# EAGLE schematic dual-dac-w-32-ch-sh-DAC-BOARD (EAGLE 7.2.0)
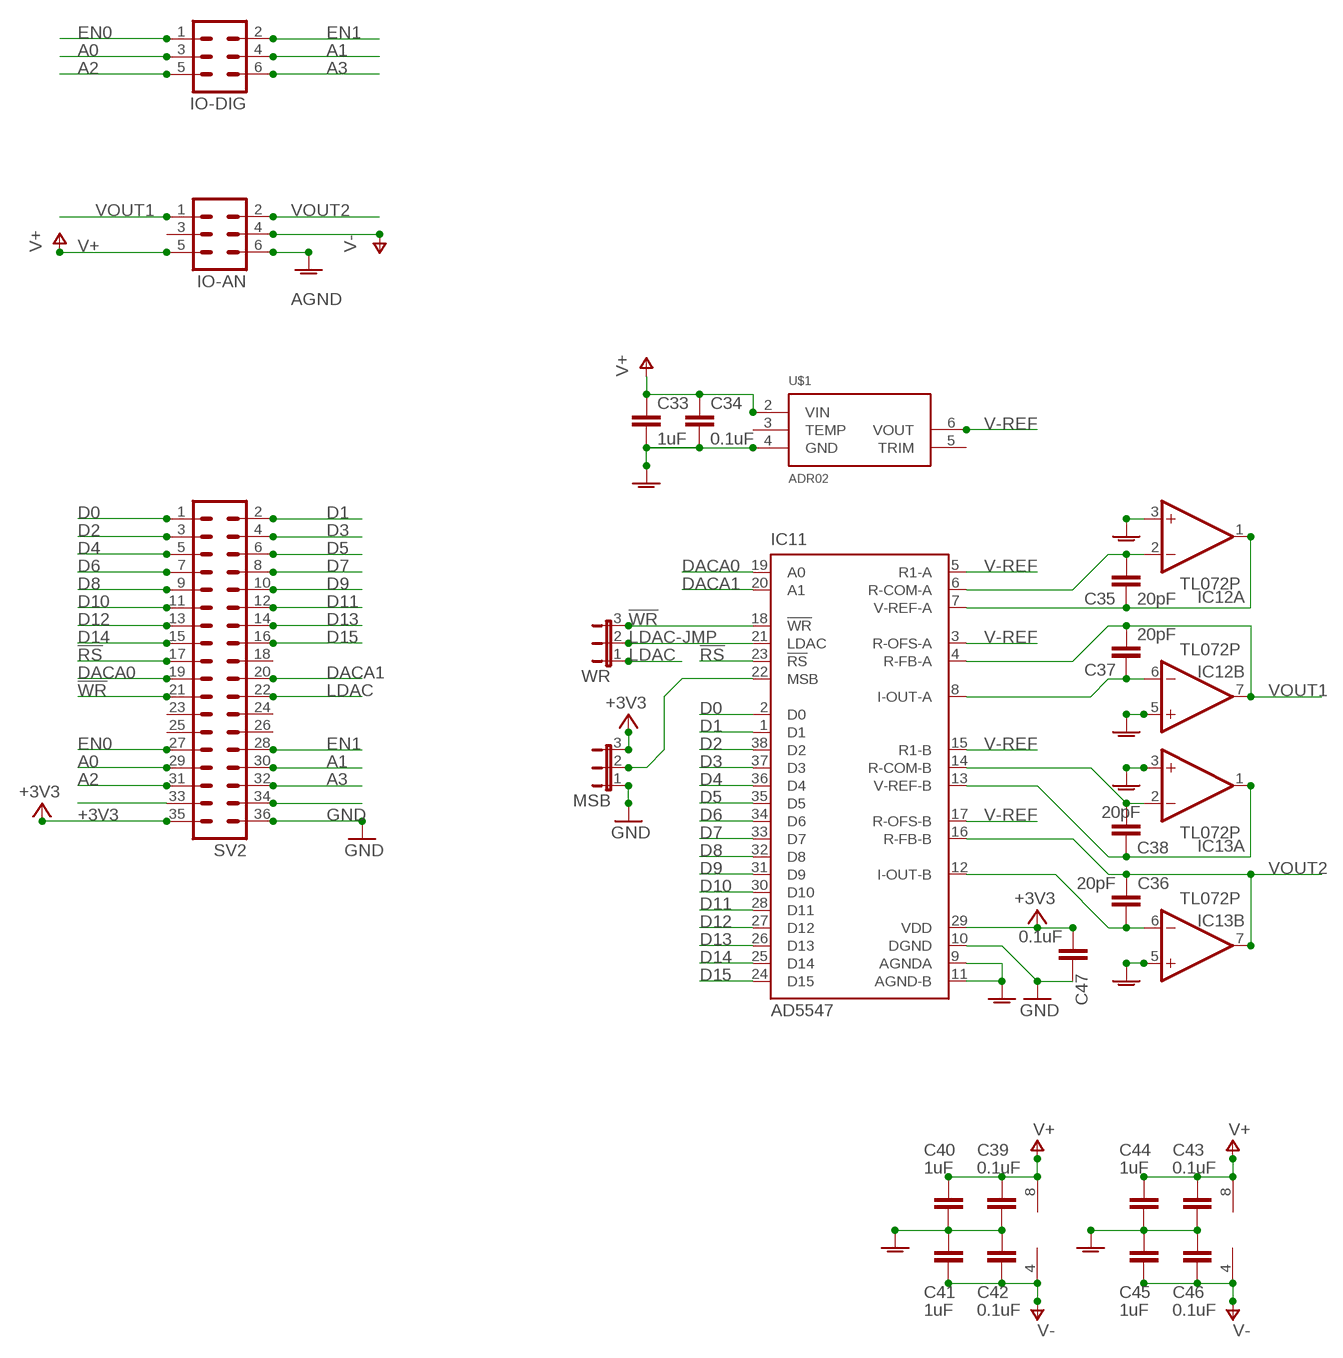
[diagram p0: schematic, sheet 1]

## Parts
C33  1uF  C-EUC0603  [C0603]
C34  0.1uF  C-EUC0603  [C0603]
C35  20pF  C-EUC0603  [C0603]
C36  20pF  C-EUC0603  [C0603]
C37  20pF  C-EUC0603  [C0603]
C38  20pF  C-EUC0603  [C0603]
C39  0.1uF  C-EUC0603  [C0603]
C40  1uF  C-EUC0603  [C0603]
C41  1uF  C-EUC0603  [C0603]
C42  0.1uF  C-EUC0603  [C0603]
C43  0.1uF  C-EUC0603  [C0603]
C44  1uF  C-EUC0603  [C0603]
C45  1uF  C-EUC0603  [C0603]
C46  0.1uF  C-EUC0603  [C0603]
C47  0.1uF  C-EUC0603  [C0603]
IC11  AD5547  [TSSOP38]
IC12  TL072P  [DIL08]
IC13  TL072P  [DIL08]
IO-AN  MA03-2  [MA03-2]
IO-DIG  MA03-2  [MA03-2]
MSB  JP2E  [JP2]
SV2  MA18-2  [MA18-2]
U$1  ADR02  [SO08]
WR  JP2E  [JP2]

## Nets
!RS: IC11.23(!RS) SV2.17
!WR: IC11.18(!WR) SV2.21 WR.3
+3V3: C47.1 IC11.29(VDD) MSB.3 SV2.35
A0: IO-DIG.3 SV2.29
A1: IO-DIG.4 SV2.30
A2: IO-DIG.5 SV2.31
A3: IO-DIG.6 SV2.32
AGND: C33.2 C34.2 C39.1 C40.1 C41.2 C42.2 C43.1 C44.1 C45.2 C46.2 IC11.9(AGNDA) IC11.11(AGND-B) IC12.3(A:+IN) IC12.5(B:+IN) IC13.3(A:+IN) IC13.5(B:+IN) IO-AN.6 U$1.4(GND)
D0: IC11.2(D0) SV2.1
D1: IC11.1(D1) SV2.2
D2: IC11.38(D2) SV2.3
D3: IC11.37(D3) SV2.4
D4: IC11.36(D4) SV2.5
D5: IC11.35(D5) SV2.6
D6: IC11.34(D6) SV2.7
D7: IC11.33(D7) SV2.8
D8: IC11.32(D8) SV2.9
D9: IC11.31(D9) SV2.10
D10: IC11.30(D10) SV2.11
D11: IC11.28(D11) SV2.12
D12: IC11.27(D12) SV2.13
D13: IC11.26(D13) SV2.14
D14: IC11.25(D14) SV2.15
D15: IC11.24(D15) SV2.16
DACA0: IC11.19(A0) SV2.19
DACA1: IC11.20(A1) SV2.20
EN0: IO-DIG.1 SV2.27
EN1: IO-DIG.2 SV2.28
GND: C47.2 IC11.10(DGND) MSB.1 SV2.36
LDAC: SV2.22 WR.1
LDAC-JMP: IC11.21(LDAC) WR.2
N$1: C35.2 IC11.6(R-COM-A) IC12.2(A:-IN)
N$2: C35.1 IC11.7(V-REF-A) IC12.1(A:OUT)
N$3: C38.2 IC11.14(R-COM-B) IC13.2(A:-IN)
N$5: C38.1 IC11.13(V-REF-B) IC13.1(A:OUT)
N$6: IC11.22(MSB) MSB.2
N$7: C36.2 IC11.12(I-OUT-B) IC13.6(B:-IN)
N$10: C37.2 IC11.8(I-OUT-A) IC12.6(B:-IN)
N$12: SV2.33
N$16: SV2.34
V+: C33.1 C34.1 C39.2 C40.2 C43.2 C44.2 IC12.8(P:V+) IC13.8(P:V+) IO-AN.5 U$1.2(VIN)
V-: C41.1 C42.1 C45.1 C46.1 IC12.4(P:V-) IC13.4(P:V-) IO-AN.4
V-REF: IC11.3(R-OFS-A) IC11.5(R1-A) IC11.15(R1-B) IC11.17(R-OFS-B) U$1.6(VOUT)
VOUT1: C37.1 IC11.4(R-FB-A) IC12.7(B:OUT) IO-AN.1
VOUT2: C36.1 IC11.16(R-FB-B) IC13.7(B:OUT) IO-AN.2
Unconnected: IO-AN.3 SV2.18 SV2.23 SV2.24 SV2.25 SV2.26 U$1.3(TEMP) U$1.5(TRIM)

## Library data of the parts
C33-C47 = resistor:C-EU: CAPACITOR, European symbol
IC11 = joakim:AD5547: Dual-Current Output, Parallel Input 16 bit Multiplying DAC Source: http://www.analog.com/media/en/technical-documentation/data-sheets/AD5547_5557.pdf
IC12 IC13 = linear:TL072: OP AMP
IO-AN IO-DIG = con-lstb:MA03-2: PIN HEADER; OC_FARNELL: unknown; OC_NEWARK: unknown
MSB WR = jumper:JP2E: JUMPER
SV2 = con-lstb:MA18-2: PIN HEADER; OC_FARNELL: unknown; OC_NEWARK: unknown
U$1 = joakim:ADR02: Ultracompact Precision 5.0V Voltage Reference Analog Devices http://docs-europe.electrocomponents.com/webdocs/10ad/0900766b810adbed.pdf